# Altium schematic sheet Power_supply.SchDoc: Triumvi - Sensing - Power Supply
size Letter; Author: Ye-Sheng Kuo; Revision: 9; SheetNumber: 4; SheetTotal: 6
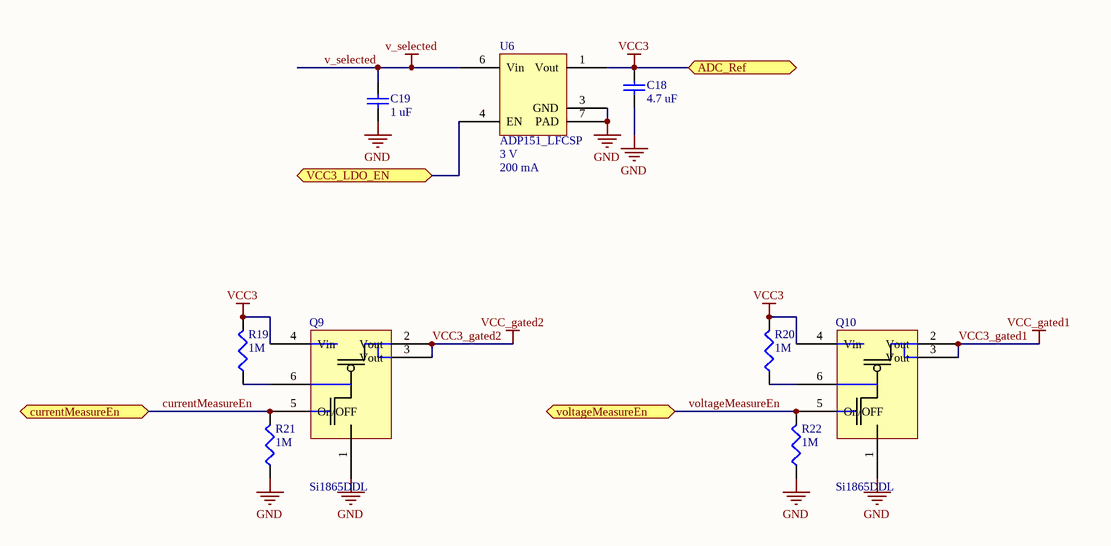
[diagram p0: Power_supply.SchDoc]

## Parts
C18  value 4.7 uF  [0603]  (hidden comment: Ceramic capacitor)
C19  value 1 uF  [0402]  (hidden comment: Ceramic capacitor)
Q9  Si1865DDL  [SC70-6]
Q10  Si1865DDL  [SC70-6]
R19  value 1M  [0402]  (hidden comment: Chip resistor)
R20  value 1M  [0402]  (hidden comment: Chip resistor)
R21  value 1M  [0402]  (hidden comment: Chip resistor)
R22  value 1M  [0402]  (hidden comment: Chip resistor)
U6  ADP151_LFCSP  Voltage: 3 V  Current: 200 mA  [CP-6-3]

## Ports
ADC_Ref, currentMeasureEn, VCC3_LDO_EN, voltageMeasureEn

## Nets
GND: C18.2 C19.2 Q9.1(S1) Q10.1(S1) R21.2 R22.2 U6.3(GND) U6.7(PAD)
v_selected: C19.1 U6.6(Vin)
VCC3: C18.1 Q9.4(Vin) Q10.4(Vin) R19.1 R20.1 U6.1(Vout) ; port ADC_Ref
VCC3_gated1: Q10.2(Vout) Q10.3(Vout)  [also labelled VCC_gated1]
VCC3_gated2: Q9.2(Vout) Q9.3(Vout)  [also labelled VCC_gated2]
currentMeasureEn: Q9.5(On/OFF) R21.1 ; port currentMeasureEn
VCC3_LDO_EN: U6.4(EN) ; port VCC3_LDO_EN
voltageMeasureEn: Q10.5(On/OFF) R22.1 ; port voltageMeasureEn
NetQ9_6: Q9.6(D1) R19.2
NetQ10_6: Q10.6(D1) R20.2

## Notes on the sheet
- Title
- Date:
- Author:
- Revision:
- Sheet
- of
- University of Michigan
- File:

## Library data of the parts
C18 = C_4.7u_10V_0603_ceramic: Ceramic capacitor, 4.7u, 10V, 0603 package; Manufacture: TDK; tolerance: 20%; Temp rating: X5R; package: 0603; voltage rated: 10 V; Supplier 1: Digi-Key; Supplier Part Number 1: 445-7482-1-ND
C19 = C_1u_16V_0402_ceramic: Ceramic capacitor, 1 uF, 16V, 0402 package; Manufacture: TDK; tolerance: 10%; Temperature rating: X5R; voltage rated: 16 V; package: 0402; Supplier 1: Digi-Key; Supplier Part Number 1: 445-4978-1-ND
Q9 Q10 = Si1865DDL: Load Switch with Level-Shift; Supplier 1: Digi-Key; Supplier Part Number 1: SI1865DDL-T1-GE3CT-ND
R19-R22 = R_1M_0402: Chip resistor, 1M, 0402 package; tolerance: 1%; power: 1/16 W; Supplier 1: Digi-Key; Supplier Part Number 1: 541-1.00MLCT-ND; package: 0402
U6 = ADP151_LFCSP: Ultralow Noise, 200 mA,  CMOS Linear Regulator; Supplier 1: Digi-Key; Supplier Part Number 1: ADP151ACPZ-3.0-R7CT-ND